# Altium schematic sheet circuit1_ver1.SchDoc
size A4
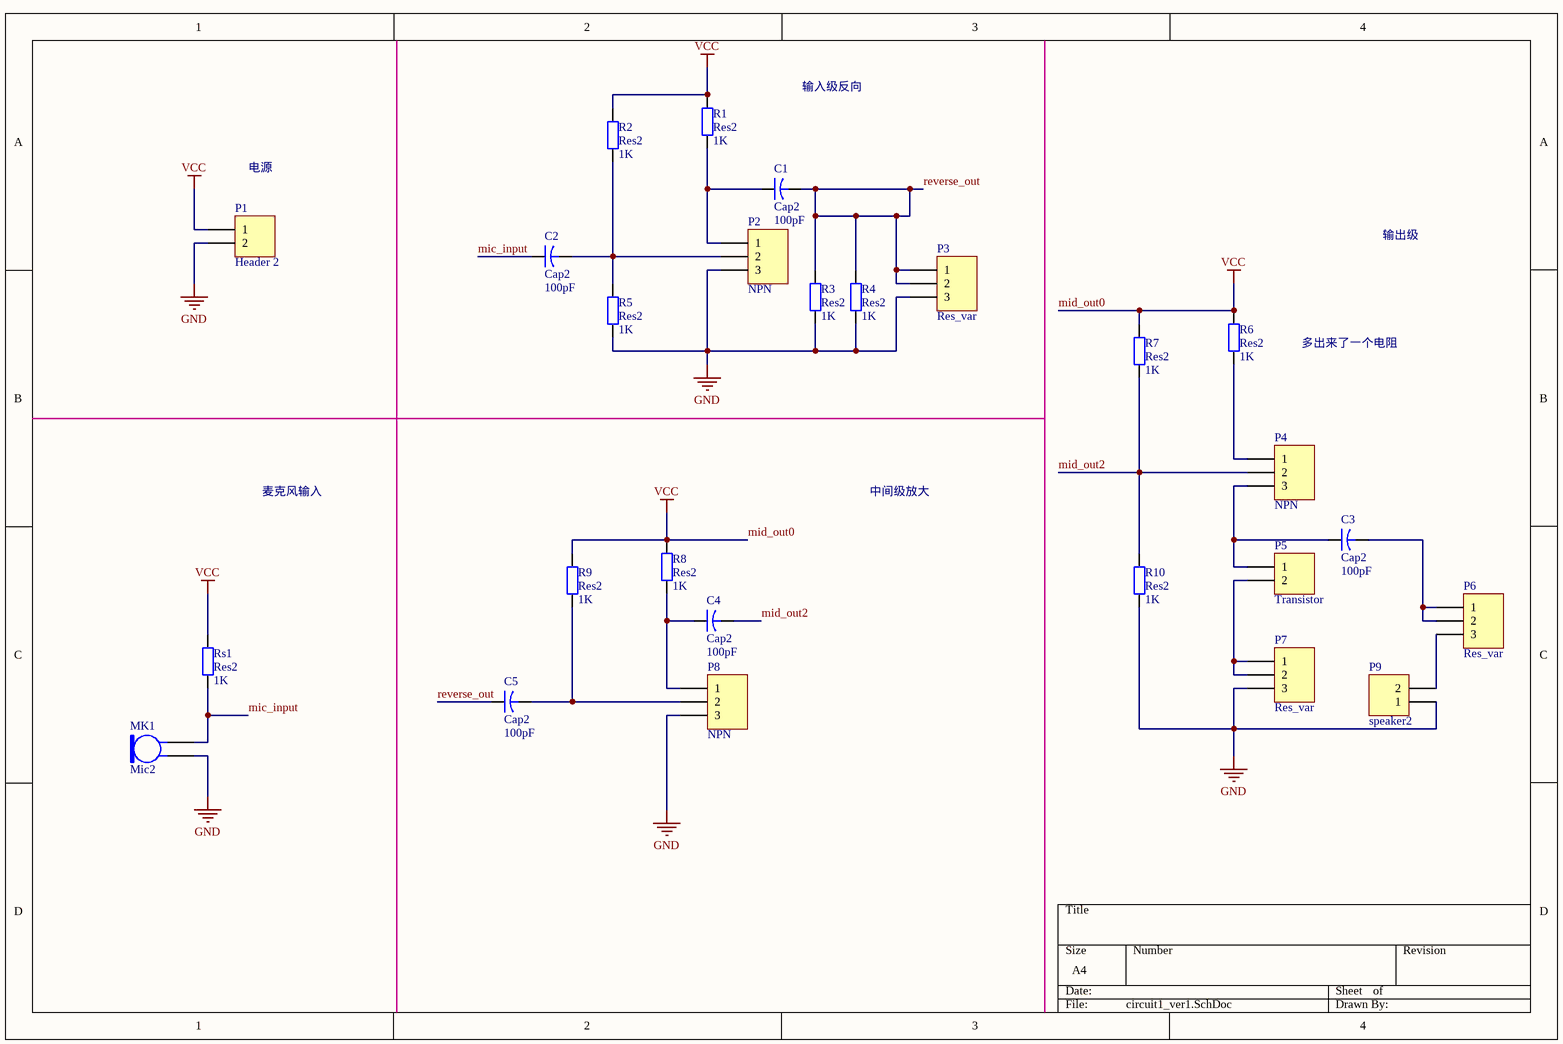
[diagram p0: circuit1_ver1.SchDoc]

## Parts
C1  Cap2  value 100pF  [CAPR5-4X5]
C2  Cap2  value 100pF  [CAPR5-4X5]
C3  Cap2  value 100pF  [CAPR5-4X5]
C4  Cap2  value 100pF  [CAPR5-4X5]
C5  Cap2  value 100pF  [CAPR5-4X5]
MK1  Mic2  [PIN2]
P1  Header 2  [HDR1X2]
P2  NPN  [HDR1X3]
P3  Res_var  [HDR1X3]
P4  NPN  [HDR1X3]
P5  Transistor  [HDR1X2]
P6  Res_var  [HDR1X3]
P7  Res_var  [HDR1X3]
P8  NPN  [HDR1X3]
P9  speaker2  [HDR1X2]
R1  Res2  value 1K  [AXIAL-0.4]
R2  Res2  value 1K  [AXIAL-0.4]
R3  Res2  value 1K  [AXIAL-0.4]
R4  Res2  value 1K  [AXIAL-0.4]
R5  Res2  value 1K  [AXIAL-0.4]
R6  Res2  value 1K  [AXIAL-0.4]
R7  Res2  value 1K  [AXIAL-0.4]
R8  Res2  value 1K  [AXIAL-0.4]
R9  Res2  value 1K  [AXIAL-0.4]
R10  Res2  value 1K  [AXIAL-0.4]
Rs1  Res2  value 1K  [AXIAL-0.4]

## Nets
GND: MK1.1 P1.2 P2.3 P3.3 P7.3 P8.3 P9.1 R3.1 R4.1 R5.1 R10.1
mid_out0: P1.1 R1.2 R2.2 R6.2 R7.2 R8.2 R9.2 Rs1.2  [also labelled VCC]
mic_input: C2.1 MK1.2 Rs1.1
mid_out2: C4.2 P4.2 R7.1 R10.2
reverse_out: C1.2 C5.1 P3.1 P3.2 R3.2 R4.2
NetC1_1: C1.1 P2.1 R1.1
NetC2_2: C2.2 P2.2 R2.1 R5.2
NetC3_1: C3.1 P4.3 P5.1
NetC3_2: C3.2 P6.1 P6.2
NetC4_1: C4.1 P8.1 R8.1
NetC5_2: C5.2 P8.2 R9.1
NetP4_1: P4.1 R6.1
NetP5_2: P5.2 P7.1 P7.2
NetP6_3: P6.3 P9.2

## Notes on the sheet
- 输入级反向
- 电源
- 输出级
- 多出来了一个电阻
- 麦克风输入
- 中间级放大

## Library data of the parts
C1-C5 = Cap2: Capacitor; Published: 23-Sep-2002; PackageReference: CAPR5-4X5; Publisher: Altium Limited; PackageDescription: Capacitor; 2 Leads
MK1 = Mic2: Microphone; Published: 24-Mar-1999; LatestRevisionDate: 17-Jul-2002; LatestRevisionNote: Re-released for DXP Platform.; PackageReference: PIN2; Publisher: Altium Limited
P1 P5 P9 = Header 2: Header, 2-Pin; LatestRevisionDate: 17-Jul-2002; LatestRevisionNote: Re-released for DXP Platform.; Publisher: Altium Limited
P2-P4 P6-P8 = Header 3: Header, 3-Pin; LatestRevisionDate: 17-Jul-2002; LatestRevisionNote: Re-released for DXP Platform.; Publisher: Altium Limited
R1-R10 Rs1 = Res2: Resistor; Published: 8-Jun-2000; LatestRevisionDate: 17-Jul-2002; LatestRevisionNote: Re-released for DXP Platform.; PackageReference: AXIAL-0.4; Publisher: Altium Limited; PackageDescription: Axial Device, Thru-Hole; 2 Leads; 0.4 in Pin Spacing